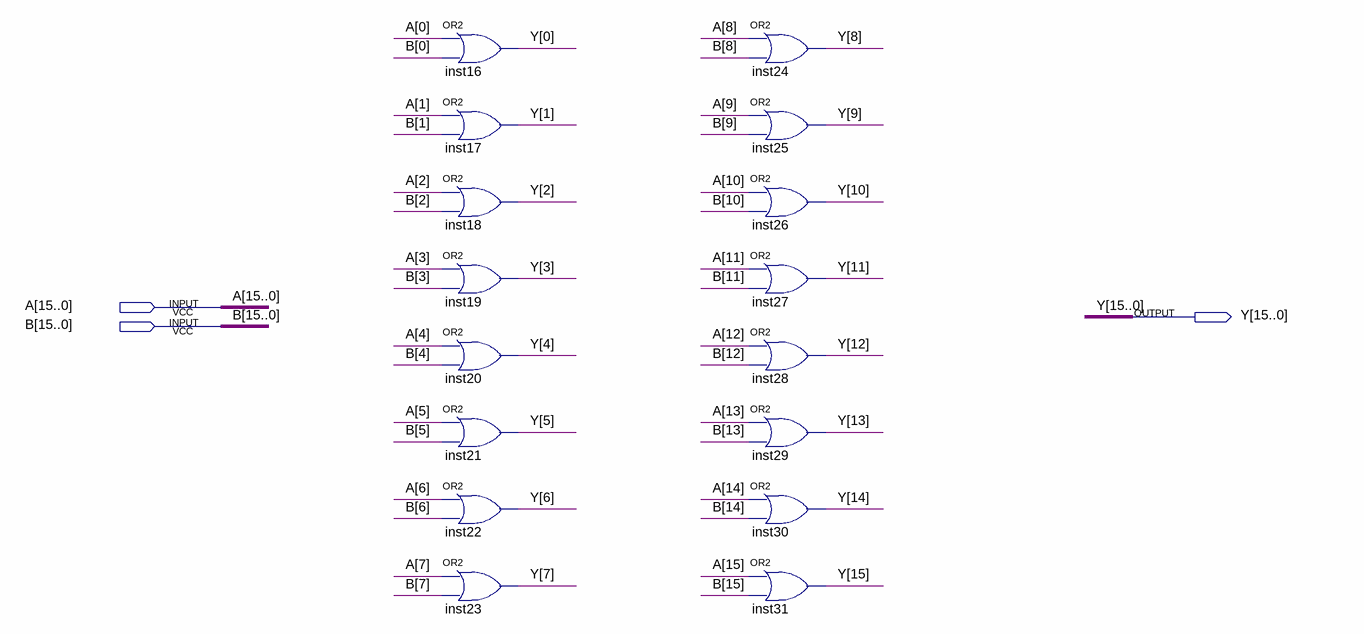
[diagram p0: schematic sheet]
// Quartus schematic or16bit.bdf as structural Verilog: 16 symbols, 3 pins
module or16bit (
  input  [15:0] A,
  input  [15:0] B,
  output [15:0] Y
);

  or inst16 (Y[0], A[0], B[0]);
  or inst17 (Y[1], A[1], B[1]);
  or inst18 (Y[2], A[2], B[2]);
  or inst19 (Y[3], A[3], B[3]);
  or inst20 (Y[4], A[4], B[4]);
  or inst21 (Y[5], A[5], B[5]);
  or inst22 (Y[6], A[6], B[6]);
  or inst23 (Y[7], A[7], B[7]);
  or inst24 (Y[8], A[8], B[8]);
  or inst25 (Y[9], A[9], B[9]);
  or inst26 (Y[10], A[10], B[10]);
  or inst27 (Y[11], A[11], B[11]);
  or inst28 (Y[12], A[12], B[12]);
  or inst29 (Y[13], A[13], B[13]);
  or inst30 (Y[14], A[14], B[14]);
  or inst31 (Y[15], A[15], B[15]);
endmodule
